# Altium schematic sheet Cana C Template.SchDoc
size 558 x 431 mm
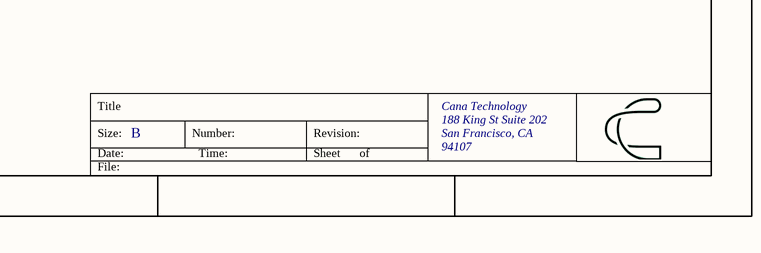
[diagram p0: Cana C Template.SchDoc, bottom right]

## Notes on the sheet
- Title
- Cana Technology
- Size:
- Date:
- File:
- B
- Number:
- Time:
- Revision:
- Sheet
- of
- 188 King St Suite 202
- San Francisco, CA
- 94107